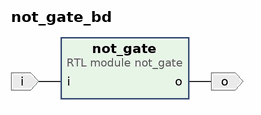
[diagram p0: block diagram of the top level]
# Vivado block design not_gate_bd, xczu3eg-sbva484-1-i, Vivado 2020.2
create_bd_design not_gate_bd

create_bd_port -dir I i
create_bd_port -dir O o

create_bd_cell -type module -reference not_gate not_gate

# ---- connections ----

connect_bd_net -net i_0_1 [get_bd_ports i] [get_bd_pins not_gate/i]
connect_bd_net -net not_gate_0_o [get_bd_pins not_gate/o] [get_bd_ports o]

validate_bd_design
save_bd_design
